# EAGLE design Qwiic_PT100 (EAGLE 9.6.0)
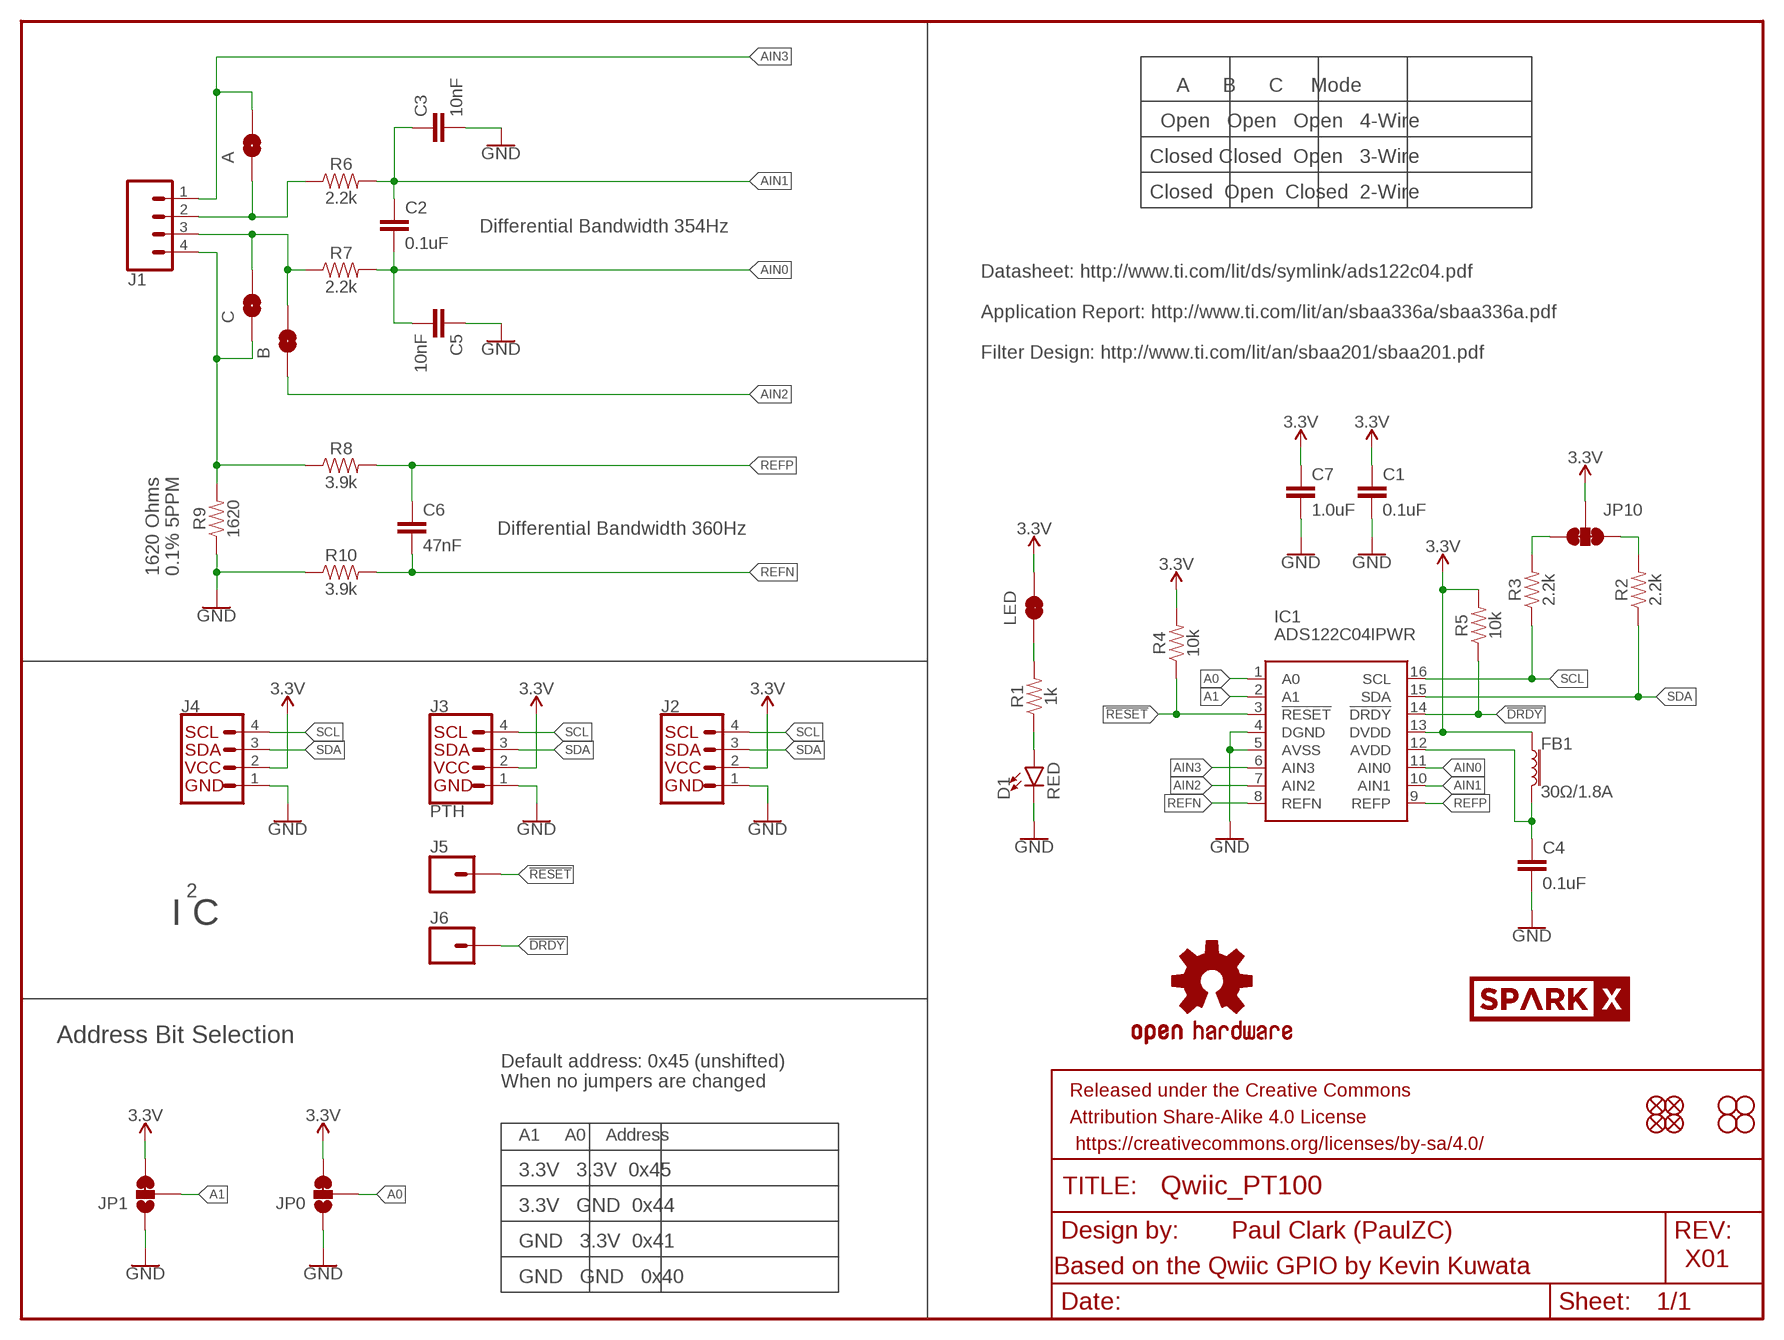
[diagram p0: schematic, sheet 1]

## Parts
A  JUMPER-SMT_2_NO_SILK_ROUND  [SMT-JUMPER_2_NO_SILK_ROUND]
B  JUMPER-SMT_2_NO_SILK_ROUND  [SMT-JUMPER_2_NO_SILK_ROUND]
C  JUMPER-SMT_2_NO_SILK_ROUND  [SMT-JUMPER_2_NO_SILK_ROUND]
C1  0.1uF  0.1UF-0603-25V-(+80/-20%)  [0603]
C2  0.1uF  0.1UF-0603-25V-5%  [0603]
C3  10nF  10NF-0603-50V-10%  [0603]
C4  0.1uF  0.1UF-0603-25V-(+80/-20%)  [0603]
C5  10nF  10NF-0603-50V-10%  [0603]
C6  47nF  47NF-0603-25V-5%  [0603]
C7  1.0uF  1.0UF-0603-16V-10%-X7R  [0603]
D1  RED  LED-RED0603  [LED-0603]
FB1  30Ω/1.8A  FERRITE_BEAD-0603  [0603]
FD1  FIDUCIAL1X2  [FIDUCIAL-1X2]
FD2  FIDUCIAL1X2  [FIDUCIAL-1X2]
FRAME1  FRAME-LETTER  [CREATIVE_COMMONS]
H1  STAND-OFF  [STAND-OFF]
H2  STAND-OFF  [STAND-OFF]
IC1  ADS122C04IPWR  [SOP65P640X120-16N]
J1  CONN_04LATCH  [LATCHTERMINAL-5MM-4]
J2  QWIIC_RIGHT_ANGLE  QWIIC_CONNECTORJS-1MM  [JST04_1MM_RA]
J3  PTH  I2C_STANDARD_NO_SILK  [1X04_NO_SILK]
J4  QWIIC_RIGHT_ANGLE  QWIIC_CONNECTORJS-1MM  [JST04_1MM_RA]
J5  CONN_01PTH_NO_SILK_YES_STOP  [1X01_NO_SILK]
J6  CONN_01PTH_NO_SILK_YES_STOP  [1X01_NO_SILK]
JP0  JUMPER-SMT_3_1-NC_TRACE_SILK  [SMT-JUMPER_3_1-NC_TRACE_SILK]
JP1  JUMPER-SMT_3_1-NC_TRACE_SILK  [SMT-JUMPER_3_1-NC_TRACE_SILK]
JP2  FIDUCIAL1X2  [FIDUCIAL-1X2]
JP3  STAND-OFF  [STAND-OFF]
JP4  STAND-OFF  [STAND-OFF]
JP6  FIDUCIAL1X2  [FIDUCIAL-1X2]
JP10  JUMPER-SMT_3_2-NC_TRACE_SILK  [SMT-JUMPER_3_2-NC_TRACE_SILK]
LED  JUMPER-SMT_2_NC_TRACE_SILK  [SMT-JUMPER_2_NC_TRACE_SILK]
LOGO1  OSHW-LOGOMINI  [OSHW-LOGO-MINI]
R1  1k  1KOHM-0603-1/10W-1%  [0603]
R2  2.2k  2.2KOHM-0603-1/10W-1%  [0603]
R3  2.2k  2.2KOHM-0603-1/10W-1%  [0603]
R4  10k  10KOHM-0603-1/10W-1%  [0603]
R5  10k  10KOHM-0603-1/10W-1%  [0603]
R6  2.2k  2.2KOHM-0603-1/10W-1%  [0603]
R7  2.2k  2.2KOHM-0603-1/10W-1%  [0603]
R8  3.9k  3.9KOHM-0603-1/10W-1%  [0603]
R9  1620  RESISTOR0603  [0603]
R10  3.9k  3.9KOHM-0603-1/10W-1%  [0603]
U$1  SPARKX-LOGO3  [SPARKX-SMALL]
U$2  SPARKX-LOGO3  [SPARKX-SMALL]

## Nets
3.3V: C1.1 C7.1 FB1.1 IC1.13(DVDD) J2.2 J3.2 J4.2 JP0.3 JP1.3 JP10.2 LED.2 R4.2 R5.2
!DRDY: IC1.14(!DRDY) J6.1 R5.1
!RESET: IC1.3(!RESET) J5.1 R4.1
A0: IC1.1(A0) JP0.2
A1: IC1.2(A1) JP1.2
AIN0: C2.2 C5.2 IC1.11(AIN0) R7.2
AIN1: C2.1 C3.1 IC1.10(AIN1) R6.2
AIN2: B.1 IC1.7(AIN2)
AIN3: A.2 IC1.6(AIN3) J1.1
GND: C1.2 C3.2 C4.2 C5.1 C7.2 D1.C IC1.4(DGND) IC1.5(AVSS) J2.1 J3.1 J4.1 JP0.1 JP1.1 R9.1 R10.1
N$1: A.1 J1.2 R6.1
N$2: D1.A R1.1
N$3: LED.1 R1.2
N$4: C4.1 FB1.2 IC1.12(AVDD)
N$5: B.2 C.2 J1.3 R7.1
N$6: C.1 J1.4 R8.1 R9.2
REFN: C6.2 IC1.8(REFN) R10.2
REFP: C6.1 IC1.9(REFP) R8.2
SCL: IC1.16(SCL) J2.4 J3.4 J4.4 R3.1
SCL_PU1: JP10.1 R2.2
SDA: IC1.15(SDA) J2.3 J3.3 J4.3 R2.1
SDA_PU1: JP10.3 R3.2

## Notes on the sheet
- A      B      C     Mode
- Open   Open   Open   4-Wire
- Closed Closed  Open   3-Wire
- Closed  Open  Closed  2-Wire
- Differential Bandwidth 354Hz
- Datasheet: http://www.ti.com/lit/ds/symlink/ads122c04.pdf
  
  Application Report: http://www.ti.com/lit/an/sbaa336a/sbaa336a.pdf
  
  Filter Design: http://www.ti.com/lit/an/sbaa201/sbaa201.pdf
- Differential Bandwidth 360Hz
- 1620 Ohms
  0.1% 5PPM
- 2
- I C
- Address Bit Selection
- Default address: 0x45 (unshifted)
  When no jumpers are changed
- A1     A0    Address
- 3.3V   3.3V  0x45
- 3.3V   GND  0x44
- Paul Clark (PaulZC)
- GND   3.3V  0x41
- X01
- Based on the Qwiic GPIO by Kevin Kuwata
- GND   GND   0x40

## Library data of the parts
A B C = SparkFun-Jumpers:JUMPER-SMT_2_NO: Normally open jumper This jumper has two pads in close proximity to each other. Apply solder to close the connection. Round pads are easier to solder for beginners, but are a lot larger. SparkFun Product that uses the round pads: SparkFun EL Sequencer <https://www.sparkfun.com/products/12781>
C1 C4 = SparkFun-Capacitors:0.1UF: 0.1µF ceramic capacitors A capacitor is a passive two-terminal electrical component used to store electrical energy temporarily in an electric field.; PROD_ID: CAP-00810
C2 = SparkFun-Capacitors:0.1UF: 0.1µF ceramic capacitors A capacitor is a passive two-terminal electrical component used to store electrical energy temporarily in an electric field.; PROD_ID: CAP-08604
C3 C5 = SparkFun-Capacitors:10NF: 0.01uF/10nF/10,000pF ceramic capacitors A capacitor is a passive two-terminal electrical component used to store electrical energy temporarily in an electric field. CAP-09321; PROD_ID: CAP-00867
C6 = SparkFun-Capacitors:47NF: 47nF ceramic capacitors A capacitor is a passive two-terminal electrical component used to store electrical energy temporarily in an electric field.; PROD_ID: CAP-08605
C7 = SparkFun-Capacitors:1.0UF: 1µF ceramic capacitors A capacitor is a passive two-terminal electrical component used to store electrical energy temporarily in an electric field.; PROD_ID: CAP-13930
D1 = SparkFun-LED:LED-RED: Red SMD LED Used in manufacturing of most products at SparkFun Packages: 0603 - SMD 0603 package [Product Link] <http://docs.avagotech.com/docs/AV02-0551EN> 0603 SMART - SMD 0603 SMART package ( more efficient and expensive)[Product Link] <http://www.osram-os.com/Graphics/XPic2/00077099_0.pdf> 1206 - SMD1206 package [Product Link] <https://www.sparkfun.com/datasheets/DevTools/LilyPad/Q150OVS4.pdff> SparkFun Products: Pro Mini 328 -5V <https://www.sparkfun.com/products/821> RedBoard <https://www.sparkfun.com/products/12757> IOIO-OTG <https://www.sparkfun.com/products/13613>; PROD_ID: DIO-00819
FB1 = SparkFun-Coils:FERRITE_BEAD: Ferrite Bead (blocks, cores, rings, chokes, etc.) Inductor with layers of ferrite used to suppress high frequencies. Often used to isolate high frequency noise. SparkFun Products: IOIO-OTG - V2.2 <https://www.sparkfun.com/products/13613> SparkFun SAMD21 Mini Breakout <https://www.sparkfun.com/products/13664> SparkFun 6 Degrees of Freedom Breakout - LSM6DS3 <https://www.sparkfun.com/products/13339> SparkFun SAMD21 Dev Breakout <https://www.sparkfun.com/products/13672>; PROD_ID: NDUC-13805
FD1 FD2 JP2 JP6 = SparkFun-Aesthetics:FIDUCIAL: Fiducial Alignment Points Point-of-reference for pick-and-place machines and other optical instruments.
FRAME1 = SparkFun-Aesthetics:FRAME-LETTER: Schematic Frame - Letter Standard 8.5x11 US Letter frame
H1 H2 JP3 JP4 = SparkFun-Hardware:STAND-OFF: Stand Off Drill holes for mechanically mounting via screws, standoffs, etc. Note: Use the keepout ring to avoid running the screw head into surrounding components. Variant Overviews STAND-OFF - Mechanical footprint for a #4 phillips button head screw. STAND-OFF-TIGHT - Mechanical footprint for a #4 phillips button head screw, Example SparkFun Products Screw - Phillips Head (1/4", 4-40, 10 pack) <https://www.sparkfun.com/products/10453> (PRT-10453) Screw - Phillips Head (1/2", 4-40, 10 pack) <https://www.sparkfun.com/products/10452> (PRT-10452) Screw - Phillips Head (3/4", 4-40, 10 pack) <https://www.sparkfun.com/products/10451> (PRT-10451) Screw - Phillips Head (1", 4-40, 10 pack) <https://www.sparkfun.com/products/10450> (PRT-10450)
IC1 = New_Parts:ADS122C04IPWR: 24-Bit, 2kSPS, 4-Ch, Low-Power Delta-Sigma ADC With PGA, Voltage Reference, IDACs and I2C Interface Source: Datasheet <http://www.ti.com/lit/gpn/ads122c04>; HEIGHT: 1.2mm; MANUFACTURER_NAME: Texas Instruments; MANUFACTURER_PART_NUMBER: ADS122C04IPWR; MOUSER_PART_NUMBER: 595-ADS122C04IPWR
J1 = SparkFun-Connectors:CONN_04: Multi connection point. Often used as Generic Header-pin footprint for 0.1 inch spaced/style header connections On any of the 0.1 inch spaced packages, you can populate with these: Break Away Headers - Straight <https://www.sparkfun.com/products/116> (PRT-00116) Break Away Male Headers - Right Angle <https://www.sparkfun.com/products/553> (PRT-00553) Female Headers <https://www.sparkfun.com/products/115> (PRT-00115) Break Away Headers - Machine Pin <https://www.sparkfun.com/products/117> (PRT-00117) Break Away Female Headers - Swiss Machine Pin <https://www.sparkfun.com/products/743> (PRT-00743) For SCREWTERMINALS and SPRING TERMINALS visit here: Screw Terimnals on SparkFun.com <https://www.sparkfun.com/search/results?term=Screw+Terminals> (5mm/3.5mm/2.54mm spacing) This device is also useful as a general connection point to wire up your design to another part of your project. Our various solder wires solder well into these plated through hole pads. Hook-Up Wire - Assortment (Stranded, 22 AWG) <https://www.sparkfun.com/products/11375> (PRT-11375) Hook-Up Wire - Assortment (Solid Core, 22 AWG) <https://www.sparkfun.com/products/11367> (PRT-11367) View the entire wire category on our website here <https://www.sparkfun.com/categories/141> Special notes: Molex polarized connector foot print use with SKU : PRT-08231 with associated crimp pins and housings. 1MM SMD Version SKU: PRT-10208; PROD_ID: CON-14722
J2 J4 = SparkFun-Connectors:QWIIC_CONNECTOR: SparkFun I2C Standard Qwiic Connector An SMD 1mm pitch JST connector makes it easy and quick (get it? Qwiic?) to connect I2C devices to each other. The Qwiic system <http://www.sparkfun.com/qwiic> enables fast and solderless connection between popular platforms and various sensors and actuators. We carry 200mm <https://www.sparkfun.com/products/14204>, 100mm <https://www.sparkfun.com/products/14205>, 50mm <https://www.sparkfun.com/products/14206>, and breadboard friendly <https://www.sparkfun.com/products/14207> Qwiic cables. We also offer 10 pcs strips <https://www.sparkfun.com/products/14323> the SMD connectors.; PROD_ID: CONN-13694
J3 = SparkFun-Connectors:I2C_STANDARD: SparkFun I2C Standard Pinout Header SparkFun has standardized on a pinout for all I2C based sensor breakouts. This pinout allows I2C boards to be plugged directly into the headers on Arduino Uno compatible boards, and to be daisy chained easily. Example SparkFun Products: SparkFun Atmospheric Sensor Breakout - BME280 <https://www.sparkfun.com/products/13676> SparkFun Altitude/Pressure Sensor Breakout - MPL3115A2 <https://www.sparkfun.com/products/11084> SparkFun TOF Range Finder Sensor - VL6180 <https://www.sparkfun.com/products/12785>
J5 J6 = SparkFun-Connectors:CONN_01: Single connection point. Often used as Generic Header-pin footprint for 0.1 inch spaced/style header connections On any of the 0.1 inch spaced packages, you can populate with these: Break Away Headers - Straight <https://www.sparkfun.com/products/116> (PRT-00116) Break Away Male Headers - Right Angle <https://www.sparkfun.com/products/553> (PRT-00553) Female Headers <https://www.sparkfun.com/products/115> (PRT-00115) Break Away Headers - Machine Pin <https://www.sparkfun.com/products/117> (PRT-00117) Break Away Female Headers - Swiss Machine Pin <https://www.sparkfun.com/products/743> (PRT-00743) This device is also useful as a general connection point to wire up your design to another part of your project. Our various solder wires solder well into these plated through hole pads. Hook-Up Wire - Assortment (Stranded, 22 AWG) <https://www.sparkfun.com/products/11375> (PRT-11375) Hook-Up Wire - Assortment (Solid Core, 22 AWG) <https://www.sparkfun.com/products/11367> (PRT-11367) View the entire wire category on our website here <https://www.sparkfun.com/categories/141> Special notes: SMTSO-256-ET is a "flush mount" nut for a 4-40 screw. We mostly use this on specialty testbeds; it is a nice way to connect hardware to your PCB at an adjustable hieght. Also note, the SNAP packages are for using a snappable style connector. We sell a baggie of snaps and they are also used on two LilyPad designs: Snap Assortment - 30 pack (male and female) <https://www.sparkfun.com/products/11347> (DEV-11347) LilyPad Arduino SimpleSnap <https://www.sparkfun.com/products/10941> (DEV-10941) LilyPad SimpleSnap Protoboard <https://www.sparkfun.com/products/10940> (DEV-10940)
JP0 JP1 = SparkFun-Jumpers:JUMPER-SMT_3_1-NC_TRACE: Normally closed trace jumper (1 of 2 connections) This jumper has a trace between two pads so it's normally closed (NC). The other connection is normally open (NO). Use a razor knife to open the connection. For best results follow the IPC guidelines for cutting traces: Cutout at least 0.063 mm (0.005 in). Remove all loose material to clean up the cut area. Seal the cut with an approved epoxy. Reapply solder to reclose the connection, or to close the NO connection.
JP10 = SparkFun-Jumpers:JUMPER-SMT_3_2-NC_TRACE: Normally closed trace jumper (2 of 2 connections) This jumper has a trace between all three pads so they are normally closed (NC). Use a razor knife to open the connection(s). For best results follow the IPC guidelines for cutting traces: Cutout at least 0.063 mm (0.005 in). Remove all loose material to clean up the cut area. Seal the cut with an approved epoxy. Reapply solder to reclose the connection(s).
LED = SparkFun-Jumpers:JUMPER-SMT_2_NC_TRACE: Normally closed trace jumper This jumper has a trace between two pads so it's normally closed (NC). Use a razor knife to open the connection. For best results follow the IPC guidelines for cutting traces: Cutout at least 0.063 mm (0.005 in). Remove all loose material to clean up the cut area. Seal the cut with an approved epoxy. Reapply solder to reclose the connection.
LOGO1 = SparkFun-Aesthetics:OSHW-LOGO: Open-Source Hardware (OSHW) Logo This logo indicates the piece of hardware it is found on incorporates a OSHW license and/or adheres to the definition of open source hardware found here: http://freedomdefined.org/OSHW
R1 = SparkFun-Resistors:1KOHM: 1kΩ resistor A resistor is a passive two-terminal electrical component that implements electrical resistance as a circuit element. Resistors act to reduce current flow, and, at the same time, act to lower voltage levels within circuits. - Wikipedia; PROD_ID: RES-07856
R2 R3 R6 R7 = SparkFun-Resistors:2.2KOHM: 2.2kΩ resistor A resistor is a passive two-terminal electrical component that implements electrical resistance as a circuit element. Resistors act to reduce current flow, and, at the same time, act to lower voltage levels within circuits. - Wikipedia; PROD_ID: RES-08272
R4 R5 = SparkFun-Resistors:10KOHM: 10kΩ resistor A resistor is a passive two-terminal electrical component that implements electrical resistance as a circuit element. Resistors act to reduce current flow, and, at the same time, act to lower voltage levels within circuits. - Wikipedia; PROD_ID: RES-00824
R8 R10 = SparkFun-Resistors:3.9KOHM: 3.9kΩ resistor A resistor is a passive two-terminal electrical component that implements electrical resistance as a circuit element. Resistors act to reduce current flow, and, at the same time, act to lower voltage levels within circuits. - Wikipedia; PROD_ID: RES-08701
R9 = New_Parts:RESISTOR: Generic Resistor Package; MOUSER_PART: 660-RN731JTTD1621B05; TEMP_COEFF: 5PPM; TOLERANCE: 0.1%
U$1 U$2 = SparkX:SPARKX-LOGO

## Board
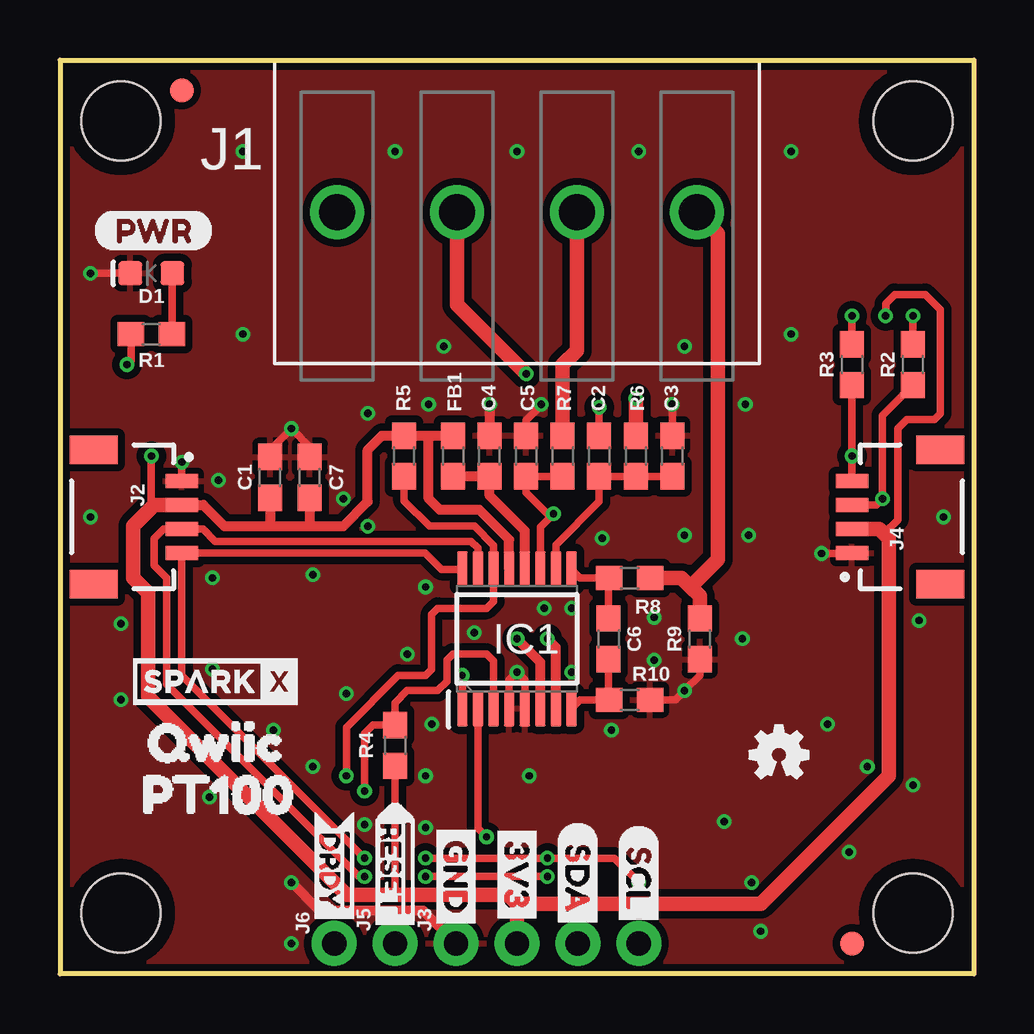
[diagram p1: board, top side]
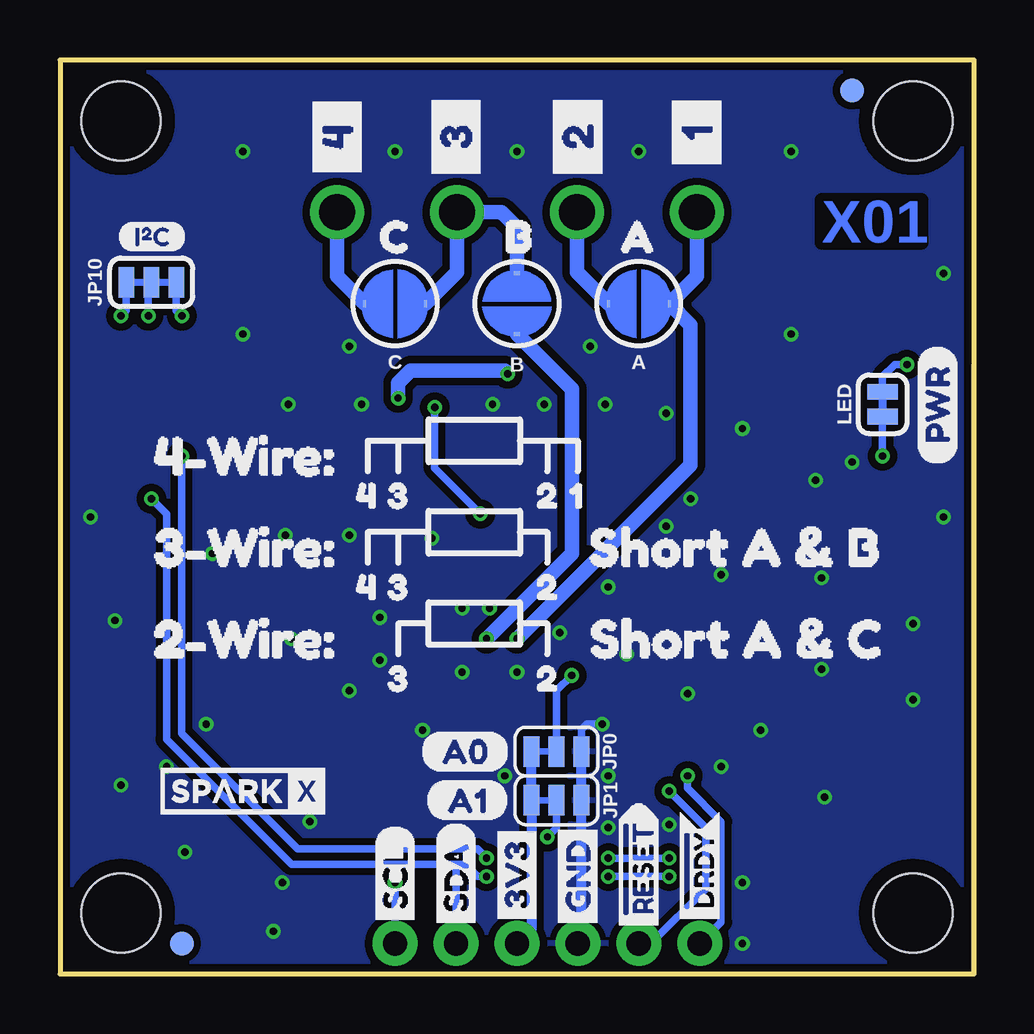
[diagram p2: board, bottom side, seen from below]

Size 38.1 x 38.1 mm. Coordinates in mm from the lower left corner, seen from the top.
Outline: 0,38.1 38.1,38.1 38.1,0 0,0 0,38.1
Copper layers (1*16): Top 0.035mm / dielectric 1.5mm / Bottom 0.035mm
Design rules "SparkFun-2-layer-PCBWay-LIMIT": minimum track width 6mil, minimum drill 0.3mm, track to track 6mil, track to pad 6mil, pad to pad 6mil, via to via 6mil, smd to smd 6mil, copper to edge 6mil, drill to drill 6mil, minimum pad ring 6mil, minimum via ring 6mil, stop-mask expansion 4mil, vias tented up to drill 25mil, thermal gap 10mil

### Footprints (pad centres in the part's own frame; a part is rotated, then mirrored left to right if it is on the bottom)
SMT-JUMPER_2_NO_SILK_ROUND = smd 0.152 x 0.305: 1 -1.27,0; 2 1.27,0
0603 = smd 1.1 x 1: 1 -0.85,0; 2 0.85,0
LED-0603 = smd 1 x 1: A -0.877,0; C 0.877,0
FIDUCIAL-1X2 = smd 1 x 1: 1 0,0
STAND-OFF = hole 3.302: 0,0
SOP65P640X120-16N = smd 1.5 x 0.45: 1 -2.9,2.275; 2 -2.9,1.625; 3 -2.9,0.975; 4 -2.9,0.325; 5 -2.9,-0.325; 6 -2.9,-0.975; 7 -2.9,-1.625; 8 -2.9,-2.275; 9 2.9,-2.275; 10 2.9,-1.625; 11 2.9,-0.975; 12 2.9,-0.325; 13 2.9,0.325; 14 2.9,0.975; 15 2.9,1.625; 16 2.9,2.275
LATCHTERMINAL-5MM-4 = drill 1.5: 1 -7.5,0; 2 -2.5,0; 3 2.5,0; 4 7.5,0
JST04_1MM_RA = smd 0.6 x 1.35: 1 -1.5,0; 2 -0.5,0; 3 0.5,0; 4 1.5,0 | smd 1.2 x 2: NC1 2.8,-3.675; NC2 -2.8,-3.675
1X04_NO_SILK = drill 1.016 pad 1.88: 1 0,0; 2 2.54,0; 3 5.08,0; 4 7.62,0
1X01_NO_SILK = drill 1.016 pad 1.88: 1 0,0
SMT-JUMPER_3_1-NC_TRACE_SILK = smd 0.66 x 1.27: 1 -1.041,0; 2 0,0; 3 1.041,0
SMT-JUMPER_3_2-NC_TRACE_SILK = smd 0.66 x 1.27: 1 -1.041,0; 2 0,0; 3 1.041,0
SMT-JUMPER_2_NC_TRACE_SILK = smd 0.66 x 1.27: 1 -0.521,0; 2 0.521,0

### Placement (x,y rotation side)
A  13.97,27.94 0 bottom
B  19.05,27.94 90 bottom
C  24.13,27.94 0 bottom
C1  8.76,20.7 90 top
C2  22.48,21.59 90 top
C3  25.53,21.59 90 top
C4  17.91,21.59 90 top
C5  19.43,21.59 270 top
C6  22.86,13.97 270 top
C7  10.41,20.7 90 top
D1  3.81,29.21 180 top
FB1  16.38,21.59 270 top
FD1  5.08,36.83 0 bottom
FD2  33.02,1.27 270 bottom
FRAME1  -11.43,-10.16 0 top  (outside the outline)
H1  35.56,35.56 0 top
H2  2.54,35.56 0 top
IC1  19.05,13.97 90 top
J1  19.05,31.75 0 top
J2  5.08,19.05 270 top
J3  16.51,1.27 0 top
J4  33.02,19.05 90 top
J5  13.97,1.27 0 top
J6  11.43,1.27 0 top
JP0  17.4,9.27 180 bottom
JP1  17.4,7.24 180 bottom
JP2  33.02,1.27 0 top
JP3  2.54,2.54 0 top
JP4  35.56,2.54 0 top
JP6  5.08,36.83 0 top
JP10  34.29,28.83 0 bottom
LED  3.81,23.75 270 bottom
LOGO1  29.97,9.14 0 top
R1  3.81,26.67 180 top
R2  35.56,25.4 90 top
R3  33.02,25.4 90 top
R4  13.97,9.53 270 top
R5  14.35,21.59 90 top
R6  24,21.59 270 top
R7  20.95,21.59 270 top
R8  23.75,16.51 180 top
R9  26.67,13.97 90 top
R10  23.75,11.43 180 top
U$1  30.48,7.62 0 bottom
U$2  6.48,12.19 0 top
U$3  [3V33]  19.05,6.48 270 top
U$4  [_1_0]  11.56,33.15 90 bottom
U$5  [A11]  22.86,7.24 0 bottom
U$6  [_2_0]  16.51,32.77 90 bottom
U$7  [GND4]  16.51,6.48 270 top
U$8  [PT1000]  2.03,7.49 0 top
U$9  [SCL6]  24.13,6.22 270 top
U$10  [SDA5]  21.59,6.35 270 top
U$11  [A00]  23.11,9.27 0 bottom
U$12  [_3_0]  21.59,32.77 90 bottom
U$13  [_4_0]  26.54,32.77 90 bottom
U$14  [#DRDY0]  11.43,6.99 270 top
U$15  [#DRDY0]  11.43,1.65 90 bottom
U$16  [#RESET0]  13.97,7.37 270 top
U$17  [#RESET0]  13.97,1.4 90 bottom
U$18  [A0]  15.88,30.73 0 bottom
U$19  [B0]  20.7,30.73 0 bottom
U$20  [I_SUPER2_C-()-03]  35.69,30.73 0 bottom
U$22  [C0]  25.91,30.73 0 bottom
U$23  [SCL0]  24.13,1.78 90 bottom
U$24  [SDA1]  21.59,1.65 90 bottom
U$25  [GND4]  16.51,1.65 90 bottom
U$26  [3V33]  19.05,1.78 90 bottom
U$29  [15]  17.78,19.94 0 bottom
U$30  [40]  26.67,19.94 0 bottom
U$31  [2#WIRE#0]  35.56,13.97 0 bottom
U$32  [QWIIC1]  2.29,9.65 0 top
U$33  [20]  19.3,19.94 0 bottom
U$34  [31]  25.53,19.94 0 bottom
U$36  [3#WIRE#0]  35.56,17.78 0 bottom
U$37  [20]  19.3,16.13 0 bottom
U$38  [31]  25.53,16.13 0 bottom
U$39  [PWR0]  1.4,30.99 0 top
U$40  [PWR0]  1.52,21.21 90 bottom
U$41  [4#WIRE#0]  35.56,21.59 0 bottom
U$42  [SHORT_A_#_B0]  17.4,17.78 0 bottom
U$43  [SHORT_A_#_C0]  17.4,13.97 0 bottom
U$44  [40]  26.67,16.13 0 bottom
U$46  [20]  19.3,12.32 0 bottom
U$47  [31]  25.53,12.32 0 bottom

### Tracks (layer width: path | path; a pad name or v marks a point on that pad's centre or on a via)
3.3V  (via drill 0.3)
  Top 0.305: v34.42,27.43 34.42,27.94 34.8,28.32 36.07,28.32 36.7,27.69 36.7,23.37 36.45,23.11 35.31,23.11 34.92,22.73 34.92,18.92 34.35,18.35 | R4.2 13.97,3.3 | v3.81,21.59 3.81,19.67 3.93,19.55
  Top 0.406: 10.41,18.66 11.8,18.66 12.83,19.68 12.83,21.84 13.42,22.44 R5.2 15.37,22.44 | 10.41,18.66 8.76,18.66 | 8.76,18.66 6.86,18.66 5.97,19.55 J2.2 | C1.1 8.76,18.66 | C7.1 10.41,18.66 | IC1.13 18.73,18.11 17.49,19.34 15.84,19.34 15.37,19.81 15.37,22.44 | 15.37,22.44 FB1.1
  Top 0.61: J3.2 19.05,2.92 | J2.2 3.93,19.55 3.05,18.67 3.05,16.51 3.68,15.88 3.68,11.56 11.94,3.3 13.97,3.3 18.67,3.3 19.05,2.92 | J4.2 34.16,18.55 34.35,18.35 34.54,18.16 34.54,8.26 29.21,2.92 19.05,2.92
  Bottom 0.305: LED.2 v3.81,21.59 | JP10.2 34.42,28.7 v34.42,27.43
  Bottom 0.406: J3.2 18.44,1.88 JP1.3 JP0.3
!DRDY  (via drill 0.3)
  Top 0.305: R5.1 14.35,19.72 15.41,18.67 17.27,18.67 18.07,17.87 IC1.14 18.07,15.54 17.78,15.24 15.75,15.24 15.49,14.99 15.49,12.7 15.24,12.45 14.1,12.45 11.94,10.29 v11.94,8.26
  Bottom 0.305: J6.1 10.54,2.16 10.54,6.35 11.94,7.75 v11.94,8.26
!RESET  (via drill 0.3)
  Top 0.305: IC1.3 18.07,13.04 17.78,13.34 16.38,13.34 16.13,13.08 16.13,12.19 15.75,11.81 14.48,11.81 13.97,11.3 R4.1 13.04,10.38 12.7,10.03 v12.7,7.62
  Bottom 0.305: J5.1 13.46,1.27 11.18,3.56 11.18,6.1 v12.7,7.62
A0  (via drill 0.3)
  Top 0.305: 16.77,12.44 IC1.1
  Top 0.406: v16.76,12.45 16.77,12.44
  Bottom 0.305: JP0.2 17.4,11.81 v16.76,12.45
A1  (via drill 0.3)
  Top 0.305: v17.78,5.71 17.43,6.07 IC1.2
  Bottom 0.305: JP1.2 17.4,6.1 v17.78,5.71
AIN0  (via drill 0.3)
  Top 0.305: R7.2 C5.2 19.43,20.07 20.32,19.18 v20.57,19.18 20.02,18.63 IC1.11 | v22.48,23.62 C2.2
  Bottom 0.305: v20.57,19.18 22.48,21.08 v22.48,23.62
AIN1
  Top 0.305: IC1.10 20.68,17.88 22.48,19.68 C2.1 R6.2 C3.1
AIN2  (via drill 0.3)
  Top 0.406: IC1.7 20.68,13.62 v20.32,13.97
  Bottom 0.61: B.1 16.76,24.38 16.76,17.53 v20.32,13.97
AIN3  (via drill 0.3)
  Top 0.406: IC1.6 20.02,12.99 v19.05,13.97
  Bottom 0.61: J1.1 11.55,29.09 A.2 11.81,27.05 11.81,21.21 v19.05,13.97
GND  (via drill 0.3)
  Top 0.305: IC1.4 18.73,12.25 v19.05,12.57 19.38,12.25 IC1.5 | C7.2 10.41,21.97 v9.65,22.73 8.76,21.84 C1.2 | v1.27,29.21 D1.C | J2.1 v5.08,21.34 | J4.1 33,17.53 v31.75,17.53 | v20.07,23.75 20.07,23.71 19.43,23.07 C5.1 | C3.2 v25.53,23.75 | R10.1 25.65,11.43 v26.04,11.81 26.67,12.45 R9.1
  Top 0.406: v17.91,23.75 C4.2 | J3.1 15.14,2.64 10.82,2.64 v9.65,3.81
  Bottom 0.305: JP0.1 16.36,10.19 16.13,10.41 v15.49,10.41
  Bottom 0.406: J3.1 16.36,1.42 JP1.1 JP0.1
  other vias: 28.83,3.81 33.66,8.64 27.69,6.35 32,10.41 29.21,1.78 32.89,5.08 35.56,7.87 2.54,11.43 6.22,7.37 8.89,10.16 6.35,12.7 10.54,8.64 6.35,16.51 15.24,16.13 20.19,15.24 21.34,15.24 21.34,12.57 24.77,14.86 24.77,13.08 2.54,14.61 1.27,19.05 6.6,20.57 11.81,19.81 12.83,18.67 12.83,23.37 36.83,19.05 17.27,14.22 14.48,13.34 10.54,16.64 11.94,11.68 22.61,18.16 26.04,18.29 28.7,18.29 28.57,23.75 15.37,23.75 13.97,34.29 19.05,34.29 24.13,34.29 30.48,34.29 30.48,26.67 7.62,26.67 7.62,34.29 16,26.16 26.04,26.16 15.24,6.1 12.7,6.22 19.56,8.26 22.99,10.16 28.45,13.97 35.81,14.73 15.24,8.26 9.65,1.27
  pour Top (isolate 0.305): 0,38.1 38.1,38.1 38.1,0 0,0
  pour Bottom (isolate 0.305): 0,38.1 38.1,38.1 38.1,0 0,0
N$1  (via drill 0.3)
  Top 0.61: J1.2 16.55,27.9 v19.43,25.02 | v24,24 R6.1
  Bottom 0.61: A.1 16.55,29.25 J1.2 | v19.43,25.02 19.56,25.15 23.5,25.15 24,24.64 v24,24
N$2
  Top 0.305: D1.A 4.69,26.7 R1.1
N$3  (via drill 0.3)
  Top 0.305: R1.2 2.96,25.57 v2.79,25.4
  Bottom 0.305: v2.79,25.4 3.3,25.4 3.81,24.89 LED.1
N$4
  Top 0.406: IC1.12 19.38,18.47 17.91,19.94 C4.1 FB1.2
N$5
  Top 0.61: R7.1 20.95,25.4 21.55,26 J1.3
  Bottom 0.61: B.2 19.05,31.11 19.68,31.75 J1.3 21.55,29.25 C.2
N$6
  Top 0.61: R8.1 25.91,16.51 26.29,16.13 | R9.2 26.67,15.75 26.29,16.13 | J1.4 27.43,30.87 27.43,17.27 26.29,16.13
  Bottom 0.61: C.1 26.55,29.09 J1.4
REFN
  Top 0.305: IC1.8 21.68,11.43 R10.2 22.86,11.47 C6.2
REFP
  Top 0.305: IC1.9 21.68,16.51 R8.2 22.86,16.47 C6.1
SCL  (via drill 0.3)
  Top 0.305: R3.1 v33.02,21.59 J4.4 | IC1.16 15.9,16.87 15.22,17.55 J2.4 5.08,12.45 v12.7,4.83 | v15.24,4.83 v20.32,4.83 23.11,4.83 v24.13,3.81
  Bottom 0.305: v12.7,4.83 v15.24,4.83 | v20.32,4.83 20.7,5.21 28.19,5.21 33.02,10.03 v33.02,21.59 | J3.4 v24.13,3.81
SCL_PU1  (via drill 0.3)
  Top 0.305: R2.2 v35.56,27.43
  Bottom 0.305: JP10.1 35.33,27.66 v35.56,27.43
SDA  (via drill 0.3)
  Top 0.305: R2.1 34.29,23.28 v34.29,19.81 34.03,19.55 J4.3 | IC1.15 17.43,17.75 17.14,18.03 6.48,18.03 5.96,18.55 J2.3 4.33,18.55 3.94,18.16 3.94,17.02 4.45,16.51 4.45,12.06 12.45,4.06 v12.7,4.06 | v20.32,4.06 v15.24,4.06
  Bottom 0.305: v15.24,4.06 v12.7,4.06 | 21.59,4.57 21.21,4.57 20.7,4.06 v20.32,4.06 | 21.59,4.57 28.45,4.57 33.66,9.78 33.66,19.18 v34.29,19.81 | J3.3 21.59,4.57
SDA_PU1  (via drill 0.3)
  Top 0.305: R3.2 v33.02,27.43
  Bottom 0.305: JP10.3 33.25,27.66 v33.02,27.43

### Text on the board
Bottom: X01